# EAGLE design OpenLog (EAGLE 7.7.0)
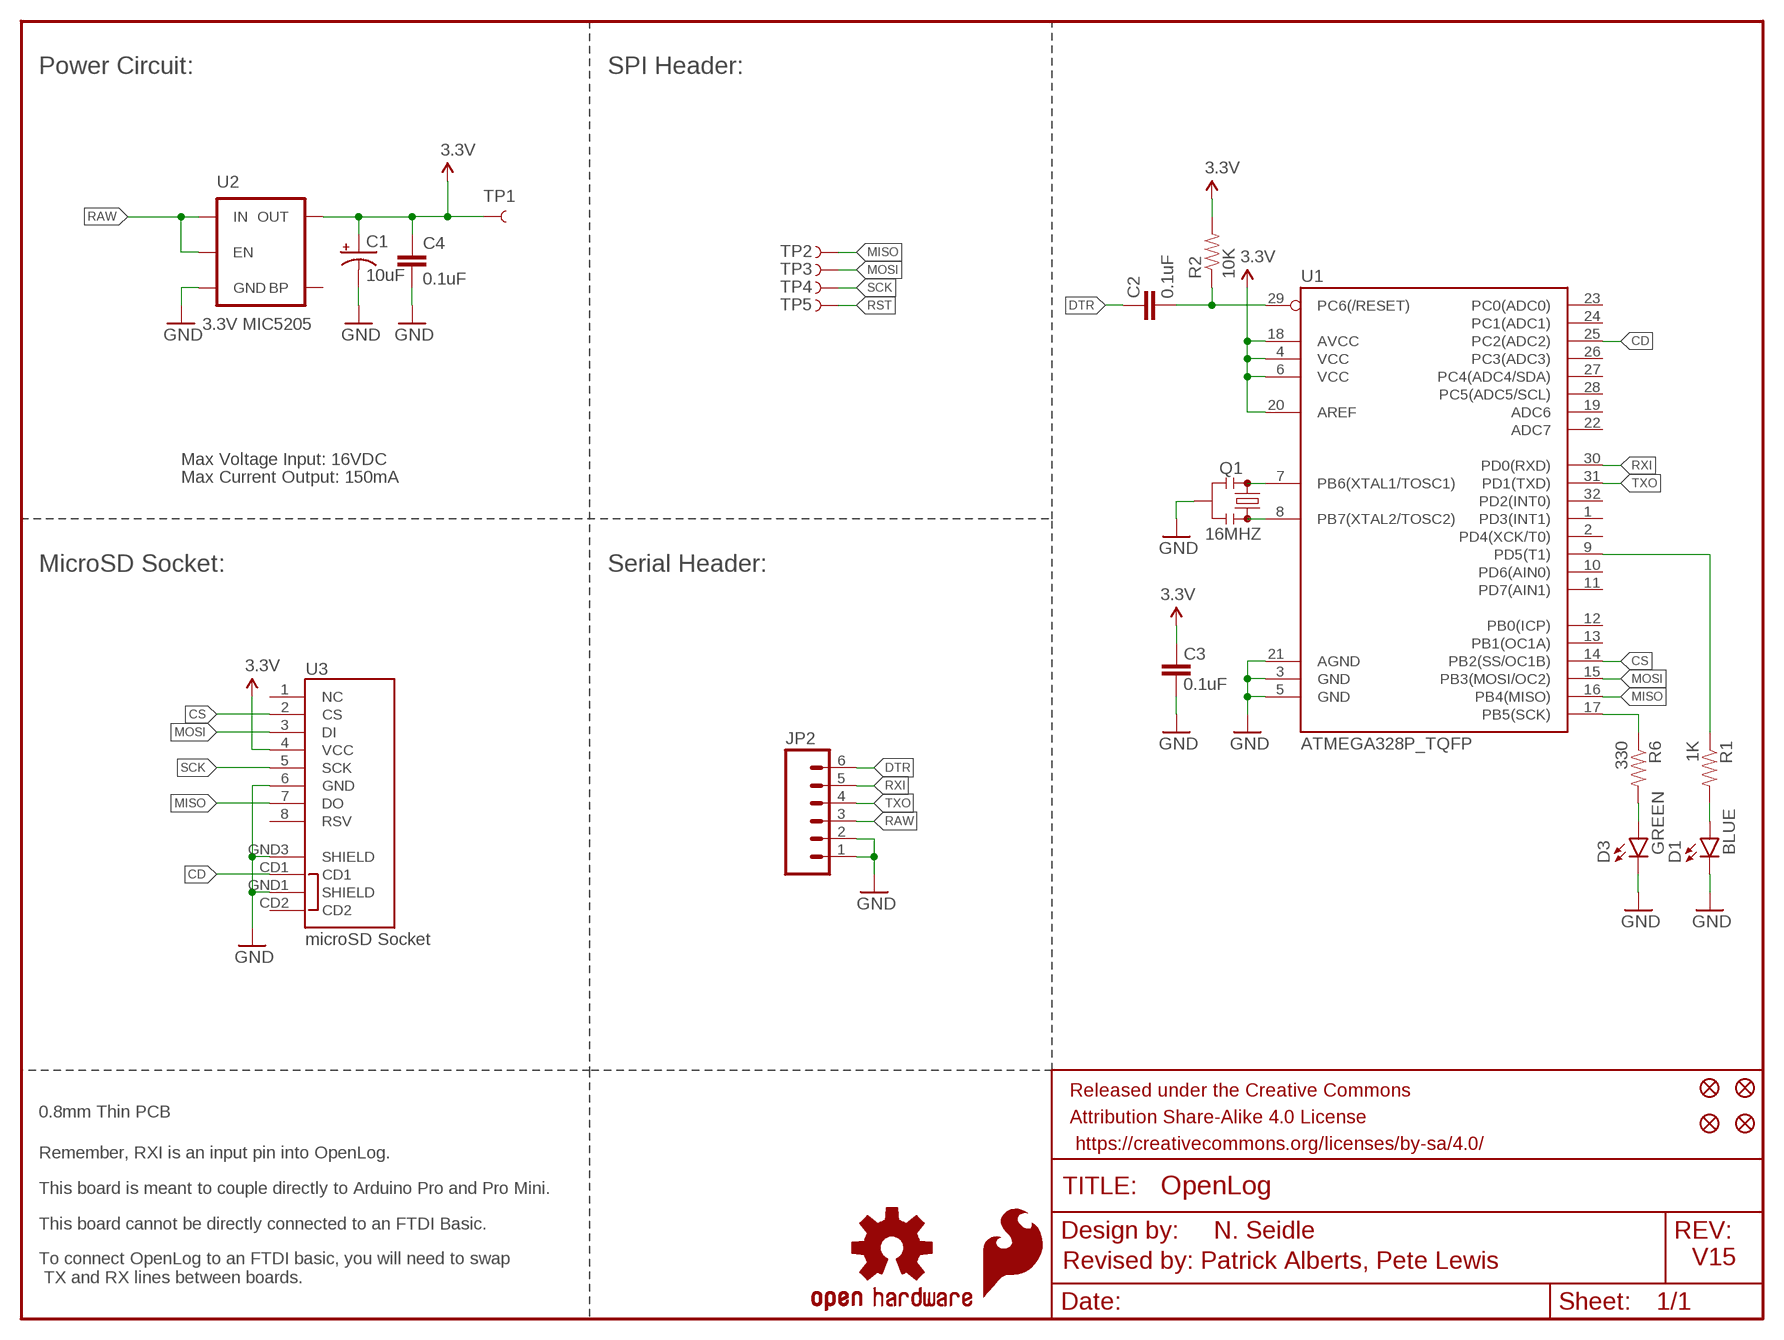
[diagram p0: schematic, sheet 1]

## Parts
C1  10uF  10UF-6.3V-20%(0603)(TANT)"  [0603-POL]
C2  0.1uF  0.1UF-25V(+80/-20%)(0603)  [0603-CAP]
C3  0.1uF  0.1UF-25V(+80/-20%)(0603)  [0603-CAP]
C4  0.1uF  0.1UF-25V(+80/-20%)(0603)  [0603-CAP]
D1  BLUE  LED-BLUE0603  [LED-0603]
D3  GREEN  LED-GREEN0603  [LED-0603]
FID1  FIDUCIALUFIDUCIAL  [MICRO-FIDUCIAL]
FID2  FIDUCIALUFIDUCIAL  [MICRO-FIDUCIAL]
FID3  FIDUCIALUFIDUCIAL  [MICRO-FIDUCIAL]
FID4  FIDUCIALUFIDUCIAL  [MICRO-FIDUCIAL]
FRAME1  FRAME-LETTER  [CREATIVE_COMMONS]
JP2  M06NO_SILK_FEMALE_PTH  [1X06_NO_SILK]
LOGO1  SFE_LOGO_FLAME.1_INCH  [SFE_LOGO_FLAME_.1]
LOGO2  OSHW-LOGOMINI  [OSHW-LOGO-MINI]
Q1  16MHZ  RESONATOR16MHZ  [RESONATOR-SMD]
R1  1K  1KOHM-1/10W-1%(0603)  [0603-RES]
R2  10K  10KOHM-1/10W-1%(0603)0603  [0603-RES]
R6  330  330OHM1/10W1%(0603)  [0603-RES]
TP1  TEST-POINT3  [PAD.03X.03]
TP2  TEST-POINT3  [PAD.03X.03]
TP3  TEST-POINT3  [PAD.03X.03]
TP4  TEST-POINT3  [PAD.03X.03]
TP5  TEST-POINT3  [PAD.03X.03]
U1  ATMEGA328P_TQFP  [TQFP32-08]
U2  3.3V MIC5205  MIC52053.3V  [SOT23-5]
U3  microSD Socket  USD-SOCKET  [MICROSD_1:1]

## Nets
3.3V: C1.A(+) C3.2 C4.1 R2.2 TP1.P$1 U1.4(VCC) U1.6(VCC) U1.18(AVCC) U1.20(AREF) U2.5(OUT) U3.4(VCC)
CD: U1.25(PC2(ADC2)) U3.CD1
CS: U1.14(PB2(SS/OC1B)) U3.2(CS)
DTR: C2.2 JP2.6
GND [vcc]: C1.K(-) C3.1 C4.2 D1.C D3.C JP2.1 JP2.2 Q1.2 U1.3(GND) U1.5(GND) U1.21(AGND) U2.2(GND) U3.6(GND) U3.GND1(SHIELD) U3.GND3(SHIELD)
MISO: TP2.P$1 U1.16(PB4(MISO)) U3.7(DO)
MOSI: TP3.P$1 U1.15(PB3(MOSI/OC2)) U3.3(DI)
N$1: Q1.1 U1.8(PB7(XTAL2/TOSC2))
N$2: Q1.3 U1.7(PB6(XTAL1/TOSC1))
N$3: D1.A R1.2
N$4: R1.1 U1.9(PD5(T1))
N$7: D3.A R6.2
RAW [vcc]: JP2.3 U2.1(IN) U2.3(EN)
RST: C2.1 R2.1 TP5.P$1 U1.29(PC6(/RESET))
RXI: JP2.5 U1.30(PD0(RXD))
SCK: R6.1 TP4.P$1 U1.17(PB5(SCK)) U3.5(SCK)
TXO: JP2.4 U1.31(PD1(TXD))
Unconnected: U1.1(PD3(INT1)) U1.2(PD4(XCK/T0)) U1.10(PD6(AIN0)) U1.11(PD7(AIN1)) U1.12(PB0(ICP)) U1.13(PB1(OC1A)) U1.19(ADC6) U1.22(ADC7) U1.23(PC0(ADC0)) U1.24(PC1(ADC1)) U1.26(PC3(ADC3)) U1.27(PC4(ADC4/SDA)) U1.28(PC5(ADC5/SCL)) U1.32(PD2(INT0)) U2.4(BP) U3.1(NC) U3.8(RSV) U3.CD2

## Notes on the sheet
- Power Circuit: | SPI Header:
- Max Voltage Input: 16VDC
- Max Current Output: 150mA
- MicroSD Socket: | Serial Header:
- 0.8mm Thin PCB
- Remember, RXI is an input pin into OpenLog.
- This board is meant to couple directly to Arduino Pro and Pro Mini.
- This board cannot be directly connected to an FTDI Basic.
- N. Seidle
- Revised by: Patrick Alberts, Pete Lewis | V15
- To connect OpenLog to an FTDI basic, you will need to swap
   TX and RX lines between boards.

## Library data of the parts
C1 = SparkFun-Capacitors:10UF-6.3V-20%(0603)(TANT); PROD_ID: CAP-13210
C2-C4 = SparkFun-Capacitors:0.1UF-25V(+80/-20%)(0603): CAP-00810 Ceramic Standard decoupling cap; PROD_ID: CAP-00810
D1 = SparkFun-LED:LED-BLUE: Blue LEDs for production use Various blue LEDs stocked by SparkFun production 0603 - DIO-08575 Rebel - DIO-09553 1206 - DIO-09911; PROD_ID: DIO-08575
D3 = SparkFun-LED:LED-GREEN: Various green LEDs Green LEDs used in SFE Production 0603- DIO-00821 LARGE- DIO-00862 LILYPAD- DIO-09910; PROD_ID: DIO-00821
FID1-FID4 = SparkFun-Aesthetics:FIDUCIAL: Fiducial Alignment Points Various fiducial points for machine vision alignment.
FRAME1 = SparkFun-Aesthetics:FRAME-LETTER: Schematic Frame Standard 8.5x11 US Letter frame
JP2 = SparkFun-Connectors:M06: Header 6 Standard 6-pin 0.1" header. Use with straight break away headers (SKU : PRT-00116), right angle break away headers (PRT-00553), swiss pins (PRT-00743), machine pins (PRT-00117), and female headers (PRT-00115). Molex polarized connector foot print use with SKU : PRT-08094 with associated crimp pins and housings. NOTES ON THE VARIANTS LOCK and LOCK_LONGPADS... This footprint was designed to help hold the alignment of a through-hole component (i.e. 6-pin header) while soldering it into place. You may notice that each hole has been shifted either up or down by 0.005 of an inch from it's more standard position (which is a perfectly straight line). This slight alteration caused the pins (the squares in the middle) to touch the edges of the holes. Because they are alternating, it causes a "brace" to hold the component in place. 0.005 has proven to be the perfect amount of "off-center" position when using our standard breakaway headers. Although looks a little odd when you look at the bare footprint, once you have a header in there, the alteration is very hard to notice. Also,if you push a header all the way into place, it is covered up entirely on the bottom side. This idea of altering the position of holes to aid alignment will be further integrated into the Sparkfun Library for other footprints. It can help hold any component with 3 or more connection pins.; PROD_ID: CONN-08437
LOGO1 = SparkFun-Aesthetics:SFE_LOGO_FLAME: SFE Logo, flame only This is the SparkFun flame logo. The logo on the schematic will always be the same size; the package variant is the height of the flame. Default layer for the logo on the board is tSilk.
LOGO2 = SparkFun-Aesthetics:OSHW-LOGO: Open Source Hardware Logo This logo indicates the piece of hardware it is found on incorporates a OSHW license and/or adheres to the definition of open source hardware found here: http://freedomdefined.org/OSHW
Q1 = SparkFun-FreqCtrl:RESONATOR: Resonator Small SMD resonator. Used, eg, on the Arduino Pro/ Pro Mini boards. 8MHz- XTAL-08895 16MHz- XTAL-08900; PROD_ID: XTAL-08900
R1 = SparkFun-Resistors:1KOHM-1/10W-1%(0603): RES-07856; PROD_ID: RES-07856
R2 = SparkFun-Resistors:10KOHM-1/10W-1%(0603): RES-00824; PROD_ID: RES-00824
R6 = SparkFun-Resistors:330OHM1/10W1%(0603): RES-00818; PROD_ID: RES-00818
TP1-TP5 = SparkFun-Passives:TEST-POINT: Bare copper test points for troubleshooting or ICT
U1 = SparkFun-DigitalIC:ATMEGA328P_TQFP; PROD_ID: IC-09069
U2 = SparkFun-PowerIC:MIC5205: MIC5205 150mA vreg 3.3V - VREG-00822 5V - VREG-00823; PROD_ID: VREG-00822
U3 = SparkFun-Connectors:USD-SOCKET: microSD Socket Push-push type uSD socket. Schematic element and footprint production proven. Spark Fun Electronics SKU : PRT-00127. tDoc lines correctly indicate media card edge positions when inserting (unlocked, locked, depressed). NOTE: CD1 and CD2 are connected internally; PROD_ID: CONN-07820

## Net classes
0 default: width 0.178 mm
1 vcc: width 0.203 mm

## Board
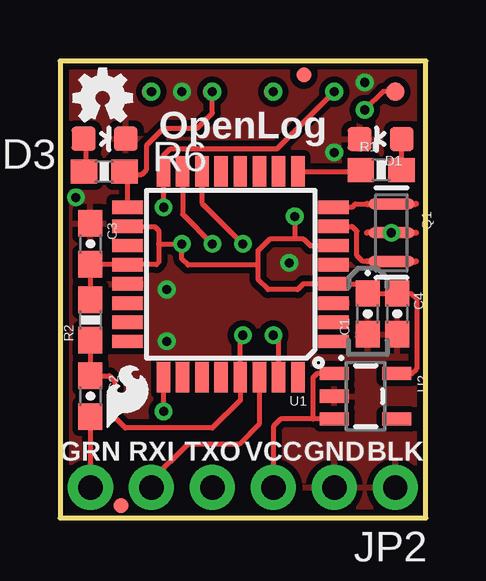
[diagram p1: board, top side]
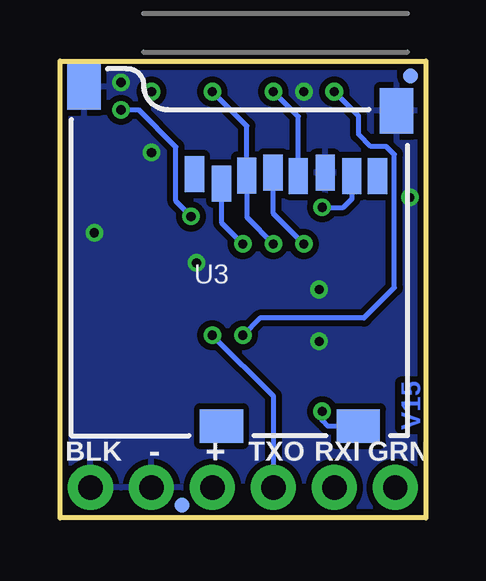
[diagram p2: board, bottom side, seen from below]

Size 15.24 x 19.05 mm. Coordinates in mm from the lower left corner, seen from the top.
Outline: 15.24,0 15.24,19.05 0,19.05 0,0 15.24,0
Copper layers (1*16): Top 0.035mm / dielectric 1.5mm / Bottom 0.035mm
Design rules "SparkFun-2-layer-TIGHT": minimum track width 7mil, minimum drill 15mil, track to track 7mil, track to pad 7mil, pad to pad 7mil, via to via 7mil, smd to smd 7mil, copper to edge 7mil, drill to drill 7mil, minimum pad ring 7mil, minimum via ring 7mil, stop-mask expansion 4mil, vias tented up to drill 20mil, thermal gap 10mil

### Footprints (pad centres in the part's own frame; a part is rotated, then mirrored left to right if it is on the bottom)
0603-POL = smd 1.1 x 1: A 0.85,0; K -0.85,0
0603-CAP = smd 1.1 x 1: 1 -0.85,0; 2 0.85,0
LED-0603 = smd 1 x 1: A 0,-0.877; C 0,0.877
MICRO-FIDUCIAL = smd 0.635 x 0.635: 1 0,0
1X06_NO_SILK = drill 1.016 pad 1.88: 1 0,0; 2 2.54,0; 3 5.08,0; 4 7.62,0; 5 10.16,0; 6 12.7,0
RESONATOR-SMD = smd 0.45 x 1.905: 1 -1.2,0; 2 0,0; 3 1.2,0
0603-RES = smd 1.1 x 1: 1 -0.85,0; 2 0.85,0
PAD.03X.03 = smd 0.762 x 0.762: P$1 0,0
TQFP32-08 = smd 1.27 x 0.559: 1 -4.293,2.8; 2 -4.293,2; 3 -4.293,1.2; 4 -4.293,0.4; 5 -4.293,-0.4; 6 -4.293,-1.2; 7 -4.293,-2; 8 -4.293,-2.8; 17 4.293,-2.8; 18 4.293,-2; 19 4.293,-1.2; 20 4.293,-0.4; 21 4.293,0.4; 22 4.293,1.2; 23 4.293,2; 24 4.293,2.8 | smd 0.559 x 1.27: 9 -2.8,-4.293; 10 -2,-4.293; 11 -1.2,-4.293; 12 -0.4,-4.293; 13 0.4,-4.293; 14 1.2,-4.293; 15 2,-4.293; 16 2.8,-4.293; 25 2.8,4.293; 26 2,4.293; 27 1.2,4.293; 28 0.4,4.293; 29 -0.4,4.293; 30 -1.2,4.293; 31 -2,4.293; 32 -2.8,4.293
SOT23-5 = smd 0.55 x 1.2: 1 -0.95,-1.3; 2 0,-1.3; 3 0.95,-1.3; 4 0.95,1.3; 5 -0.95,1.3
MICROSD_1:1 = smd 0.8 x 1.5: 1 5.096,10.919; 2 6.218,10.519; 3 7.274,10.853; 4 8.367,10.982; 5 9.421,10.828; 6 10.539,10.973; 7 11.648,10.819; 8 12.721,10.819 | smd 1.8 x 1.4: CD1 11.92,0.4; CD2 6.22,0.4 | smd 1.4 x 1.9: GND1 0.497,14.55; GND3 13.52,13.55

### Placement (x,y rotation side)
C1  12.83,8.51 90 top
C2  1.27,5.08 270 top
C3  1.27,11.43 270 top
C4  14.05,8.51 270 top
D1  13.36,15.8 90 top
D3  1.86,15.81 270 top
FID1  10.16,18.47 0 top
FID2  2.54,0.51 0 top
FID3  10.16,0.53 0 bottom
FID4  0.64,18.44 0 bottom
FRAME1  -21.06,-15.24 0 top  (outside the outline)
JP2  13.97,1.27 180 top
LOGO1  1.65,3.43 0 top
LOGO2  1.78,17.53 0 top
Q1  13.81,11.89 270 top
R1  13.38,14.51 0 top
R2  1.27,8.26 90 top
R6  1.84,14.45 180 top
TP1  13.97,17.78 0 top
TP2  11.43,17.78 270 top
TP3  8.89,17.78 270 top
TP4  6.35,17.78 270 top
TP5  3.81,17.78 270 top
U1  7.11,10.16 180 top
U2  12.73,5.08 270 top
U3  14.73,3.43 0 bottom

### Tracks (layer width: path | path; a pad name or v marks a point on that pad's centre or on a via)
3.3V  (via drill 0.38)
  Top 0.203: 9.78,11.65 8.77,11.65 8.25,11.13 8.25,10.54 | 9.78,11.65 10.13,11.65 10.42,11.36 U1.6 | v9.78,12.57 9.78,11.65 | U1.18 2.84,12.14 3.95,12.14 4.11,11.99 4.11,11.43 | R2.2 C3.2 1.29,10.56 U1.20 4.01,10.56 4.11,10.65 4.11,11.43 | 4.11,11.43 v5.08,11.43 5.08,10.79 5.33,10.54 8.25,10.54 | 8.25,10.54 8.25,9.95 8.67,9.53 9.9,9.53 10.14,9.76 10.9,9.76 U1.4 12.43,9.76 C1.A C4.1 14.64,9.36 14.86,9.14 14.86,6.22 14.66,6.03 U2.5 | TP1.P$1 13.46,17.78 v12.7,17.02
  Bottom 0.203: U3.4 6.37,12.71 v5.08,11.43 | v12.7,17.02 11.96,17.02 10.41,15.47 10.41,13.21 v9.78,12.57
CD  (via drill 0.38)
  Top 0.203: U1.25 v4.31,4.45 v4.32,4.45
  Bottom 0.203: U3.CD1 4.08,3.83 4.32,4.06 v4.32,4.45
CS  (via drill 0.38)
  Top 0.203: U1.14 5.91,13.14 v7.62,11.43
  Bottom 0.203: U3.2 8.51,12.32 v7.62,11.43
DTR
  Top 0.203: JP2.6 C2.2
GND  (via drill 0.38)
  other vias: 4.45,9.53 13.81,11.89 9.55,10.64 0.66,13.37 5.08,17.78 12.7,18.16 4.45,7.37 11.43,15.24
  pour Top (isolate 0.254): 15.24,0 0,0 0,19.05 15.24,19.05
  pour Bottom (isolate 0.254): 15.24,0 0,0 0,19.05 15.24,19.05
MISO  (via drill 0.38)
  Top 0.203: TP2.P$1 9.04,15.39 4.6,15.39 4.31,15.11 U1.16 v4.31,12.96 v4.32,12.95
  Bottom 0.203: U3.7 3.08,13.3 3.43,12.95 v4.32,12.95
  other vias: 11.43,17.78
MOSI  (via drill 0.38)
  Top 0.203: U1.15 5.11,12.67 v6.35,11.43 6.1,11.68
  Bottom 0.203: TP3.P$1 7.46,16.35 U3.3 7.46,12.54 v6.35,11.43
  other vias: 8.89,17.78
N$1
  Top 0.203: U1.8 12.17,12.96 12.31,13.1 12.79,13.1
N$2
  Top 0.203: 12.93,10.7 12.79,10.7 12.62,10.7 12.37,10.95 12.37,11.96 12.17,12.16 U1.7
N$3
  Top 0.203: R1.2 D1.A
N$4
  Top 0.203: U1.9 12.47,14.45 R1.1
N$7
  Top 0.203: R6.2 1.09,14.36 1.09,15.71 D3.A
RAW
  Top 0.203: U2.1 10.73,6.03 10.54,5.84 10.54,4.13 | JP2.3 8.89,3.81 9.21,4.13 10.54,4.13 | U2.3 10.54,4.13
RST  (via drill 0.38)
  Top 0.203: R2.1 C2.1 2.07,5.93 2.29,5.71 2.29,4.19 2.73,3.75 6.35,3.75 7.51,4.91 U1.29 7.51,7.51 v7.62,7.62
  Bottom 0.203: TP5.P$1 2.79,16.76 2.79,16 2.29,15.49 1.65,15.49 1.31,15.15 1.31,9.6 2.58,8.33 6.91,8.33 v7.62,7.62
  other vias: 3.81,17.78
RXI
  Top 0.203: U1.30 8.31,3.93 7.46,3.08 5.33,3.08 3.81,1.56 JP2.5
SCK  (via drill 0.38)
  Top 0.203: U1.17 2.82,14.32 | 2.82,14.32 R6.1 | 2.82,14.32 3.4,14.32 3.61,14.53 3.61,15.54 4.32,16.26 5.71,16.26 6.35,16.89 TP4.P$1
  Bottom 0.203: U3.5 5.31,16.74 TP4.P$1
  other vias: 6.35,17.78
TXO  (via drill 0.38)
  Top 0.203: U1.31 9.11,7.4 v8.89,7.62
  Bottom 0.203: v8.89,7.62 6.35,5.08 JP2.4

### Text on the board
Bottom: V15
tPlace: OpenLog | GRN | RXI | TXO | VCC | GND | BLK
bPlace: GRN | RXI | TXO | + | - | BLK
tDocu: 0.8mm Thin PCB | N. Seidle | Revised by: Patrick Alberts, Pete Lewis